# EAGLE schematic PT80 (EAGLE 9.5.2)
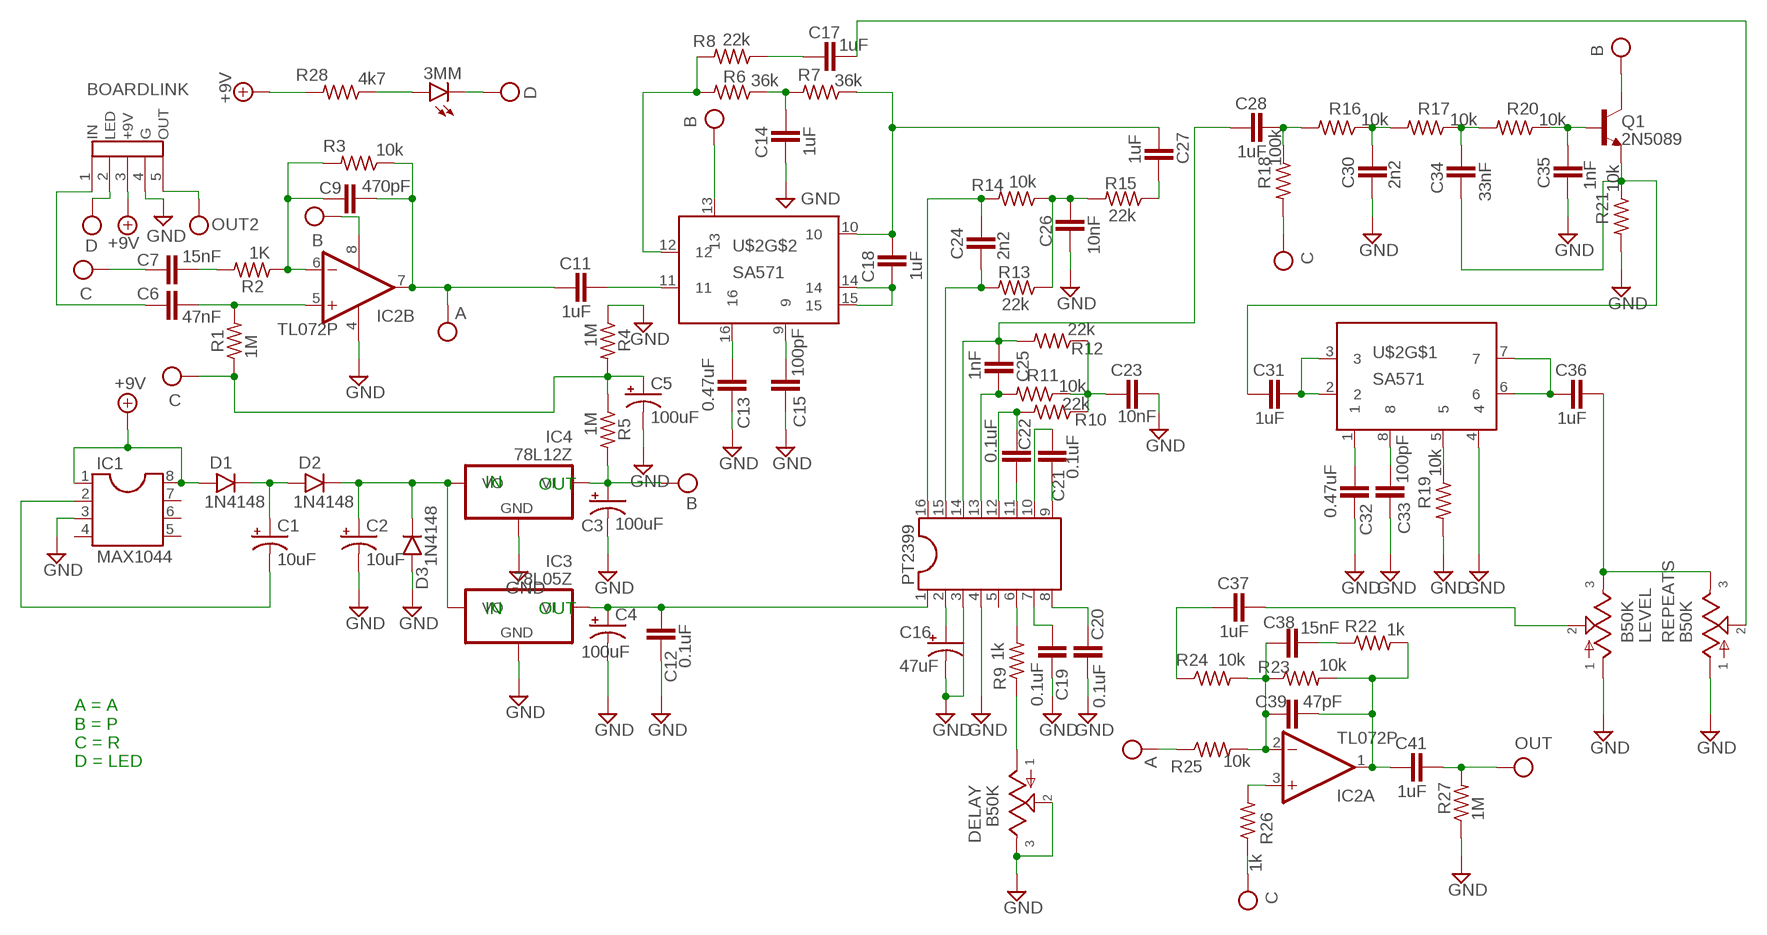
[diagram p0: schematic, sheet 1]

## Parts
3MM  LED3MM  [LED3MM]
C1  10uF  0501  [050_020_1]
C2  10uF  0501  [050_020_1]
C3  100uF  0801  [080_035_1]
C4  100uF  0801  [080_035_1]
C5  100uF  0801  [080_035_1]
C6  47nF  072X0352  [072X035]
C7  15nF  072X0252  [072X025]
C9  470pF  050X030_0251  [050X030_025]
C11  1uF  072X0452  [072X045]
C12  0.1uF  072X0352  [072X035]
C13  0.47uF  072X0352  [072X035]
C14  1uF  072X0452  [072X045]
C15  100pF  050X030_0251  [050X030_025]
C16  47uF  0631  [063_025]
C17  1uF  072X0452  [072X045]
C18  1uF  072X0452  [072X045]
C19  0.1uF  072X0352  [072X035]
C20  0.1uF  072X0352  [072X035]
C21  0.1uF  072X0352  [072X035]
C22  0.1uF  072X0352  [072X035]
C23  10nF  072X0252  [072X025]
C24  2n2  072X0252  [072X025]
C25  1nF  072X0252  [072X025]
C26  10nF  072X0252  [072X025]
C27  1uF  072X0452  [072X045]
C28  1uF  072X0452  [072X045]
C30  2n2  072X0252  [072X025]
C31  1uF  072X0452  [072X045]
C32  0.47uF  072X0352  [072X035]
C33  100pF  050X030_0251  [050X030_025]
C34  33nF  072X0252  [072X025]
C35  1nF  072X0252  [072X025]
C36  1uF  072X0452  [072X045]
C37  1uF  072X0452  [072X045]
C38  15nF  072X0252  [072X025]
C39  47pF  050X030_0251  [050X030_025]
C41  1uF  072X0452  [072X045]
D1  1N4148  1N4148-3  [DO35-3]
D2  1N4148  1N4148-3  [DO35-3]
D3  1N4148  1N4148-3  [DO35-3]
DELAY  B50K  POT16MM  [16MM]
IC1  MAX1044  [DIL08]
IC2  TL072P  [DIL08]
IC3  78L05Z  [TO92]
IC4  78L12Z  [TO92]
LEVEL  B50K  POT16MM  [16MM]
PT2399  DIL16  [DIL16]
Q1  2N5089  [TO92-]
R1  1M  6MM.3  [R0207/3]
R2  1K  6MM.3  [R0207/3]
R3  10k  6MM.3  [R0207/3]
R4  1M  6MM.3  [R0207/3]
R5  1M  6MM.3  [R0207/3]
R6  36k  6MM.3  [R0207/3]
R7  36k  6MM.3  [R0207/3]
R8  22k  6MM.3  [R0207/3]
R9  1k  6MM.3  [R0207/3]
R10  22k  6MM.3  [R0207/3]
R11  10k  6MM.3  [R0207/3]
R12  22k  6MM.3  [R0207/3]
R13  22k  6MM.3  [R0207/3]
R14  10k  6MM.3  [R0207/3]
R15  22k  6MM.3  [R0207/3]
R16  10k  6MM.3  [R0207/3]
R17  10k  6MM.3  [R0207/3]
R18  100k  6MM.3  [R0207/3]
R19  10k  6MM.3  [R0207/3]
R20  10k  6MM.3  [R0207/3]
R21  10k  6MM.3  [R0207/3]
R22  1k  6MM.3  [R0207/3]
R23  10k  6MM.3  [R0207/3]
R24  10k  6MM.3  [R0207/3]
R25  10k  6MM.3  [R0207/3]
R26  1k  6MM.3  [R0207/3]
R27  1M  6MM.3  [R0207/3]
R28  4k7  6MM.3  [R0207/3]
REPEATS  B50K  POT16MM  [16MM]
U$1  BOARDLINK  [BOARDLINK]
U$2  SA571  [DIL16]

## Nets
+9V: D1.A IC1.1 IC1.8 R28.2 U$1.3(+9V)
A: C9.2 C11.1 IC2.7(B:OUT) R3.1 R25.1
B: C3.+ IC2.8(P:V+) IC4.1(VI) Q1.1(C) R5.2 U$2.13
C: C5.+ C7.1 R1.1 R4.2 R5.1 R18.2 R26.1
D: 3MM.K(C) U$1.2(LED)
GND: C2.- C3.- C4.- C5.- C12.1 C13.2 C14.1 C15.1 C16.- C19.2 C20.2 C23.2 C26.1 C30.1 C32.2 C33.1 C35.1 D3.A DELAY.2 DELAY.3 IC1.3 IC2.4(P:V-) IC3.2(GND) IC4.2(GND) LEVEL.1 PT2399.3 PT2399.4 R4.1 R19.2 R21.2 R27.1 REPEATS.1 U$1.4(G) U$2.4
N$1: C2.+ D2.C D3.C IC3.3(VO) IC4.3(VO)
N$2: C1.+ D1.C D2.A
N$3: C1.- IC1.2
N$4: 3MM.A R28.1
N$5: C11.2 U$2.11
N$6: C4.+ C12.2 IC3.1(VI) PT2399.1
N$7: C6.1 U$1.1(IN)
N$8: C6.2 IC2.5(B:+IN) R1.2
N$9: C7.2 R2.2
N$10: C9.1 IC2.6(B:-IN) R2.1 R3.2
N$11: R6.2 R8.2 U$2.12
N$12: C17.1 R8.1
N$13: C14.2 R6.1 R7.2
N$14: C18.1 U$2.14 U$2.15
N$15: C18.2 C27.1 R7.1 U$2.10
N$16: C13.1 U$2.16
N$17: C15.2 U$2.9
N$18: C16.+ PT2399.2
N$19: PT2399.6 R9.2
N$20: DELAY.1 R9.1
N$21: C19.1 PT2399.7
N$22: C20.1 PT2399.8
N$23: C21.2 PT2399.9
N$24: C21.1 PT2399.10
N$25: C22.2 PT2399.11
N$26: C22.1 PT2399.12 R10.2
N$27: C23.1 R10.1 R11.1 R12.1
N$28: C25.1 PT2399.13 R11.2
N$29: C25.2 C28.1 PT2399.14 R12.2
N$30: C24.2 PT2399.16 R14.2
N$31: C24.1 PT2399.15 R13.2
N$32: C27.2 R15.1
N$33: C26.2 R13.1 R14.1 R15.2
N$34: C31.2 U$2.2 U$2.3
N$35: C28.2 R16.2 R18.1
N$36: C30.2 R16.1 R17.2
N$37: C34.2 R17.1 R20.2
N$38: C35.2 Q1.2(B) R20.1
N$39: C31.1 C34.1 Q1.3(E) R21.1
N$40: C38.2 C39.2 IC2.2(A:-IN) R23.1 R24.2 R25.2
N$41: IC2.3(A:+IN) R26.2
N$42: C36.1 U$2.6 U$2.7
N$43: C32.1 U$2.1
N$44: C33.2 U$2.8
N$45: R19.1 U$2.5
N$46: C37.2 LEVEL.2
N$48: C36.2 LEVEL.3 REPEATS.3
N$49: C37.1 R24.1
N$50: C38.1 R22.1
N$51: C39.1 C41.1 IC2.1(A:OUT) R22.2 R23.2
N$52: C17.2 REPEATS.2
OUT: C41.2 R27.2 U$1.5(OUT)
Unconnected: IC1.4 IC1.5 IC1.6 IC1.7 PT2399.5

## Notes on the sheet
- IN | OUT
- IN | OUT
- A = A
  B = P
  C = R
  D = LED

## Library data of the parts
3MM = mb_diodes:LED
C1 C2 = mb_caps-electro:050: 0.22 - 100uF Xicon values at Mouser.com: 10V: 10 - 100uF; 16V: 2.2 - 47uF; 25V: 0.47 - 47uF; 50V: 0.22 - 22uF
C3-C5 = mb_caps-electro:080: 47 - 470uF Xicon values at Mouser.com 10V: 330, 470uF; 16V: 220, 330uF; 25V: 220uF; 50V: 47, 100uF
C6 C12 C13 C19-C22 C32 = mb_caps-box:072X035: 0.15 - 1.0uF; WIMA MKP2 63, 100V: 0.047uF; MKS2 50V: 0.68 - 1.0uF; 63V: 0.33 - 0.47uF; 100V: 0.15 - 0.22uF;
C7 C23-C26 C30 C34 C35 C38 = mb_caps-box:072X025: 1000pF - 0.47uF WIMA MKP2 63, 100V: 1000pF - 0.015uF; MKS2 50V: 0.33 - 0.47uF; 63V: 1000pF - 0.22uF;
C9 C15 C33 C39 = mb_caps-ceramic:050X030_025: 47 - 120pF Xicon Ceramic Disc 2.5mm lead spacing
C11 C14 C17 C18 C27 C28 C31 C36 C37 C41 = mb_caps-box:072X045: 1.5uF WIMA MKS 2 50V: 1.5uF; 63V: 0.68uF; 100V: 0.33uF
C16 = mb_caps-electro:063: 33 - 220uF Xicon values at Mouser.com 10V: 220uF; 16V: 100uF; 25V: 100uF; 50V: 33uF
D1-D3 = mb_diodes:1N4148: Fast Switching Diode DO-35 glass case a.k.a. 1N914
DELAY LEVEL REPEATS = mb_pots:POT: Potentiometers the arrow indicates the clockwise motion of th wiper (lug 2) fully counter clockwise there is no resistance between lugs 1 and 2 fully clockwise the resistance between lugs 1 and 2 is the value of the pot
IC1 = mb_ics:MAX1044
IC2 = mb_ics:TL072: OP AMP
IC3 IC4 = mb_regulators:78*: Positive VOLTAGE REGULATOR Source: http://cache.national.com/ds/LM/LM78L05.pdf http://www.fairchildsemi.com/ds/LM/LM7805.pdf
PT2399 = mb_ics:DIL16
Q1 = mb_trans:2N5089: NPN TRANSISTOR EBC pinout also works for 2N3565
R1-R28 = mb_resistors:6MM: 6mm Resistors Leads spaced 1-6 holes apart for 0.1" perfboard. Suitable for 1/4 watt resistors.
U$1 = xc_library:BOARDLINK
U$2 = xc_library:SA571